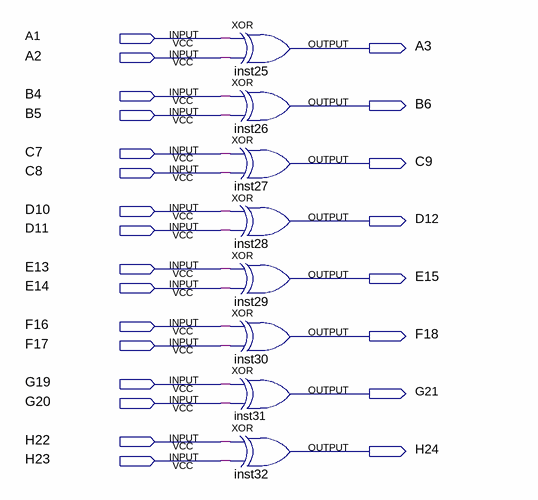
[diagram p0: schematic sheet]
// Quartus schematic xor8.bdf as structural Verilog: 8 symbols, 24 pins
module xor8 (
  input  A1,
  input  A2,
  input  B4,
  input  B5,
  input  C7,
  input  C8,
  input  D10,
  input  D11,
  input  E13,
  input  E14,
  input  F16,
  input  F17,
  input  G19,
  input  G20,
  input  H22,
  input  H23,
  output A3,
  output B6,
  output C9,
  output D12,
  output E15,
  output F18,
  output G21,
  output H24
);

  xor inst25 (A3, A1, A2);
  xor inst26 (B6, B4, B5);
  xor inst27 (C9, C7, C8);
  xor inst28 (D12, D10, D11);
  xor inst29 (E15, E13, E14);
  xor inst30 (F18, F16, F17);
  xor inst31 (G21, G19, G20);
  xor inst32 (H24, H22, H23);
endmodule
